# Altium project 无线声量计.PrjPcb
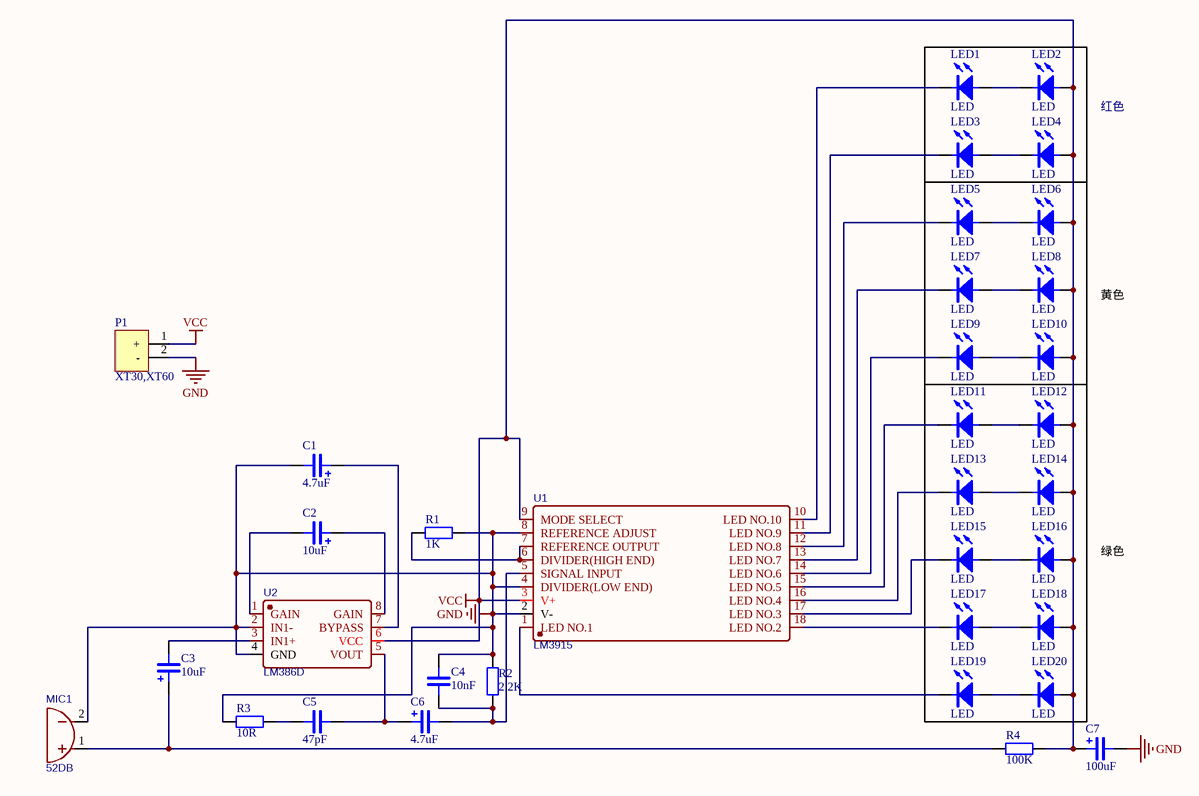
[diagram p0: 无线声量计.SchDoc]
1 sheet, 35 parts. Net scope: global (net labels, ports and power ports of the same name join across sheets).
Board file: 无线声量计.PcbDoc

## Sheet 无线声量计.SchDoc
size A4; SheetNumber: 1; SheetTotal: 1

### Parts
C1  4.7uF  [CAP-6.3X6.3X12]
C2  10uF  [CAP-6.3X6.3X12]
C3  10uF  [CAP-6.3X6.3X12]
C4  10nF  [0603_C]
C5  47pF  [0603_C]
C6  4.7uF  [CAP-6.3X6.3X12]
C7  100uF  [CAP-6.3X6.3X12]
LED1  LED  [LED 2.54mm 直插式 5mm]
LED2  LED  [LED 2.54mm 直插式 5mm]
LED3  LED  [LED 2.54mm 直插式 5mm]
LED4  LED  [LED 2.54mm 直插式 5mm]
LED5  LED  [LED 2.54mm 直插式 5mm]
LED6  LED  [LED 2.54mm 直插式 5mm]
LED7  LED  [LED 2.54mm 直插式 5mm]
LED8  LED  [LED 2.54mm 直插式 5mm]
LED9  LED  [LED 2.54mm 直插式 5mm]
LED10  LED  [LED 2.54mm 直插式 5mm]
LED11  LED  [LED 2.54mm 直插式 5mm]
LED12  LED  [LED 2.54mm 直插式 5mm]
LED13  LED  [LED 2.54mm 直插式 5mm]
LED14  LED  [LED 2.54mm 直插式 5mm]
LED15  LED  [LED 2.54mm 直插式 5mm]
LED16  LED  [LED 2.54mm 直插式 5mm]
LED17  LED  [LED 2.54mm 直插式 5mm]
LED18  LED  [LED 2.54mm 直插式 5mm]
LED19  LED  [LED 2.54mm 直插式 5mm]
LED20  LED  [LED 2.54mm 直插式 5mm]
MIC1  52DB  [MIC-TH_BD9.7-P2.54-D0.8-L-FD]
P1  XT30,XT60  [XT60U-M]
R1  1K  [0603_R]
R2  2.2K  [0603_R]
R3  10R  [0603_R]
R4  100K  [0603_R]
U1  LM3915  [DIP-18]
U2  LM386D  [DIP-8]

### Nets
GND: C1.2 C4.2 C7.2 MIC1.2 P1.2(-) R1.1 R2.2 R3.1 U1.2(V-) U1.4(DIVIDER(LOW_END)) U1.8(REFERENCE_ADJUST) U2.2(IN1-) U2.4(GND)
VCC: C7.1 LED2.1(A) LED4.1(A) LED6.1(A) LED8.1(A) LED10.1(A) LED12.1(A) LED14.1(A) LED16.1(A) LED18.1(A) LED20.1(A) P1.1(+) R4.1 U1.3(V+) U1.9(MODE_SELECT) U2.6(VCC)
NetC1_1: C1.1 U2.7(BYPASS)
NetC2_1: C2.1 U2.8(GAIN)
NetC2_2: C2.2 U2.1(GAIN)
NetC3_1: C3.1 MIC1.1 R4.2
NetC3_2: C3.2 U2.3(IN1+)
NetC4_1: C4.1 C6.2 R2.1 U1.5(SIGNAL_INPUT)
NetC5_1: C5.1 R3.2
NetC5_2: C5.2 C6.1 U2.5(VOUT)
NetLED1_1: LED1.1(A) LED2.2(C)
NetLED1_2: LED1.2(C) U1.10(LED_NO.10)
NetLED3_1: LED3.1(A) LED4.2(C)
NetLED3_2: LED3.2(C) U1.11(LED_NO.9)
NetLED5_1: LED5.1(A) LED6.2(C)
NetLED5_2: LED5.2(C) U1.12(LED_NO.8)
NetLED7_1: LED7.1(A) LED8.2(C)
NetLED7_2: LED7.2(C) U1.13(LED_NO.7)
NetLED9_1: LED9.1(A) LED10.2(C)
NetLED9_2: LED9.2(C) U1.14(LED_NO.6)
NetLED11_1: LED11.1(A) LED12.2(C)
NetLED11_2: LED11.2(C) U1.15(LED_NO.5)
NetLED13_1: LED13.1(A) LED14.2(C)
NetLED13_2: LED13.2(C) U1.16(LED_NO.4)
NetLED15_1: LED15.1(A) LED16.2(C)
NetLED15_2: LED15.2(C) U1.17(LED_NO.3)
NetLED17_1: LED17.1(A) LED18.2(C)
NetLED17_2: LED17.2(C) U1.18(LED_NO.2)
NetLED19_1: LED19.1(A) LED20.2(C)
NetLED19_2: LED19.2(C) U1.1(LED_NO.1)
NetR1_2: R1.2 U1.6(DIVIDER(HIGH_END)) U1.7(REFERENCE_OUTPUT)

### Notes on the sheet
- 红色
- (near LED8) 黄色
- (near LED16) 绿色

### Library data of the parts
C1-C3 C6 C7 = CAP-TANTALUM: Tantalum Capacitor
C4 C5 = CAP: Capacitor
MIC1 = 52DB: 咪头; BOM_Manufacturer: INGHAi; BOM_Manufacturer Part: GMI9767P-30DB; Contributor: LCSC; BOM_Supplier: LCSC; BOM_Supplier Part: C234012; BOM_JLCPCB Part Class: Extended Part; spicePre: M; spiceSymbolName: GMI9767P-30DB
P1 = XT: 电源接口
R1-R4 = RES: Resistor
U1 = LM3915: LED照明驱动器; BOM_Manufacturer: XINLUDA(信路达); BOM_Manufacturer Part: XD3915; Contributor: LCSC; BOM_Supplier: LCSC; BOM_Supplier Part: C609778; BOM_JLCPCB Part Class: Extended Part; spicePre: U; spiceSymbolName: XD3915
U2 = LM386D: 音频功率放大器; BOM_Manufacturer: HTC Korea TAEJIN Tech; Contributor: LCSC; BOM_Supplier: LCSC; BOM_Supplier Part: C510560; BOM_Manufacturer Part: LM386D; BOM_JLCPCB Part Class: Extended Part; spicePre: U; spiceSymbolName: LM386D